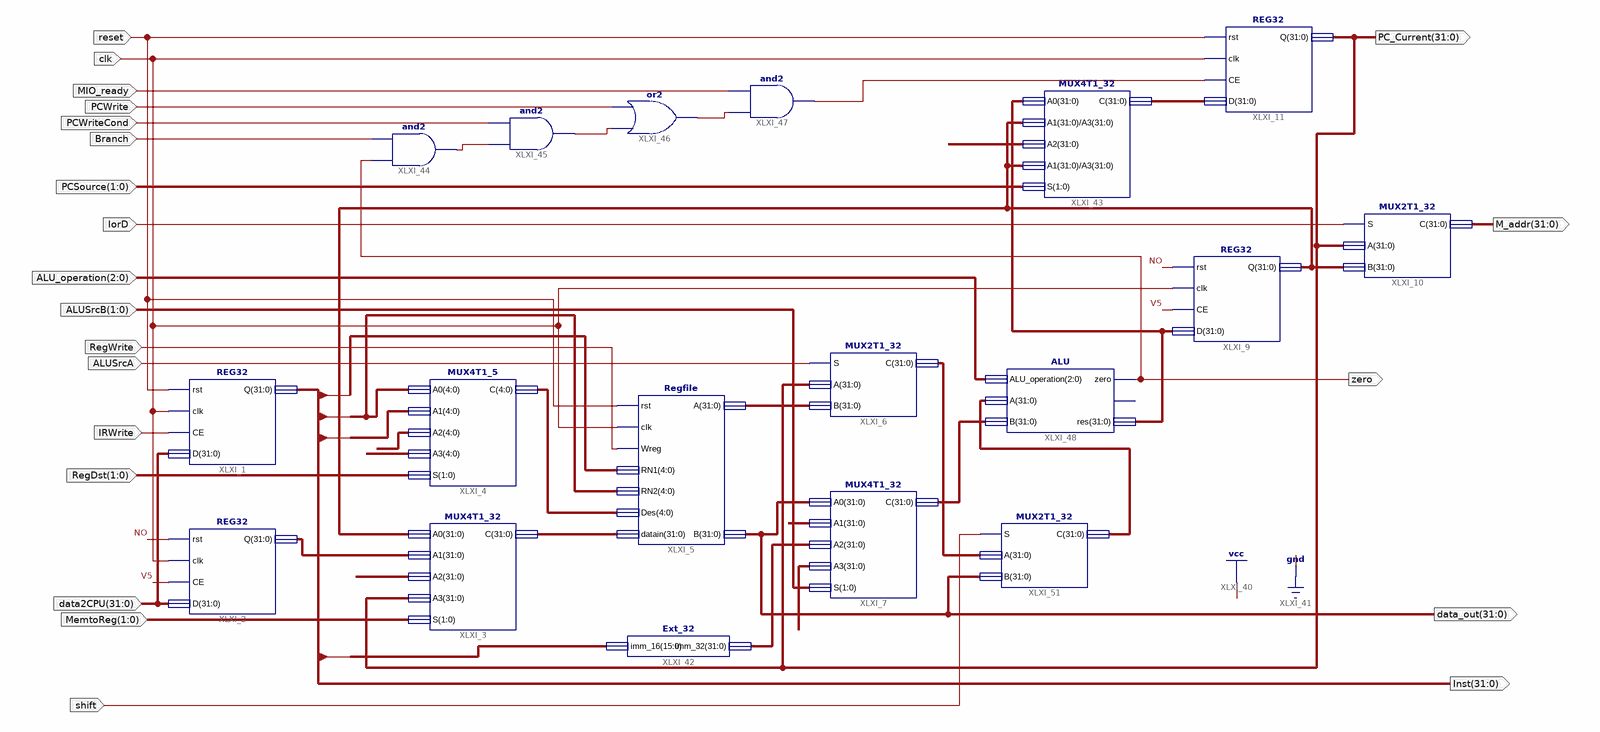
[diagram p0: schematic sheet 1]
// Xilinx ISE schematic M_datapath.sch (kintex7) as structural Verilog: 18 symbols, 22 ports
module M_datapath (
  input  reset,
  input  clk,
  input  IRWrite,
  input  [31:0] data2CPU,
  input  [1:0] RegDst,
  input  [1:0] MemtoReg,
  input  RegWrite,
  input  ALUSrcA,
  input  [1:0] ALUSrcB,
  input  [2:0] ALU_operation,
  input  IorD,
  input  [1:0] PCSource,
  input  Branch,
  input  PCWriteCond,
  input  PCWrite,
  input  MIO_ready,
  input  shift,
  output [31:0] Inst,
  output [31:0] data_out,
  output zero,
  output [31:0] PC_Current,
  output [31:0] M_addr
);

  wire XLXN_64, XLXN_65, XLXN_66, XLXN_76;
  wire [4:0] XLXN_37;
  wire [29:0] imm32;
  wire [31:0] A, ALU_out, B, Q, RdataA, res, XLXN_38, XLXN_43, XLXN_77, XLXN_81;

  MUX4T1_32 XLXI_3 (.A0(ALU_out), .A1(Q), .A2({Inst[15:0], {16{1'b0}}}), .A3(PC_Current), .S(MemtoReg), .C(XLXN_38));
  MUX4T1_5 XLXI_4 (.A0(Inst[20:16]), .A1(Inst[15:11]), .A2({5{1'b1}}), .A3({5{1'b0}}), .S(RegDst), .C(XLXN_37));
  REG32 XLXI_1 (.rst(reset), .clk(clk), .CE(IRWrite), .D(data2CPU), .Q(Inst));
  REG32 XLXI_2 (.rst(1'b0), .clk(clk), .CE(1'b1), .D(data2CPU), .Q(Q));
  Regfile XLXI_5 (
    .rst(reset), .clk(clk), .Wreg(RegWrite), .RN1(Inst[25:21]), .RN2(Inst[20:16]), .Des(XLXN_37),
    .datain(XLXN_38), .A(RdataA), .B(data_out));
  REG32 XLXI_9 (.rst(1'b0), .clk(clk), .CE(1'b1), .D(res), .Q(ALU_out));
  MUX2T1_32 XLXI_10 (.S(IorD), .A(PC_Current), .B(ALU_out), .C(M_addr));
  REG32 XLXI_11 (.rst(reset), .clk(clk), .CE(XLXN_76), .D(XLXN_77), .Q(PC_Current));
  MUX2T1_32 XLXI_6 (.S(ALUSrcA), .A(PC_Current), .B(RdataA), .C(A));
  MUX4T1_32 XLXI_7 (
    .A0(data_out), .A1(32'b00000000000000000000000000000100), .A2(XLXN_43), .A3({imm32, 2'b00}), .S(ALUSrcB),
    .C(B));
  Ext_32 XLXI_42 (.imm_16(Inst[15:0]), .imm_32(XLXN_43));
  MUX4T1_32 XLXI_43 (
    .A0(res), .A1(ALU_out), .A2({PC_Current[31:28], Inst[25:0], 2'b00}), .A3(ALU_out), .S(PCSource),
    .C(XLXN_77));
  and XLXI_44 (XLXN_64, zero, Branch);
  and XLXI_45 (XLXN_65, XLXN_64, PCWriteCond);
  or XLXI_46 (XLXN_66, XLXN_65, PCWrite);
  and XLXI_47 (XLXN_76, XLXN_66, MIO_ready);
  ALU XLXI_48 (.ALU_operation(ALU_operation), .A(XLXN_81), .B(B), .zero(zero), .res(res));  // open: overflow
  MUX2T1_32 XLXI_51 (.S(shift), .A(A), .B(data_out), .C(XLXN_81));
endmodule
